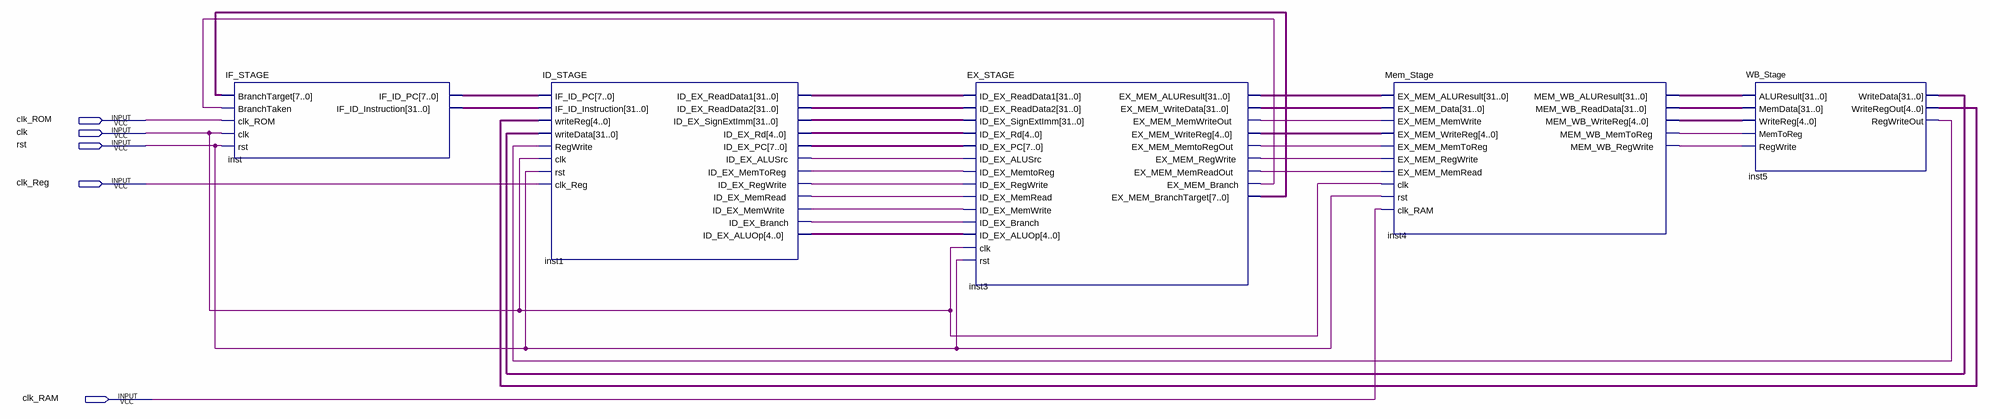
[diagram p0: schematic sheet]
// Quartus schematic ProcessadorPipeline.bdf as structural Verilog: 5 symbols, 5 pins
module ProcessadorPipeline (
  input  clk_ROM,
  input  clk,
  input  rst,
  input  clk_Reg,
  input  clk_RAM
);

  wire inst1_id_ex_alusrc, inst1_id_ex_branch, inst1_id_ex_memread, inst1_id_ex_memtoreg,
       inst1_id_ex_memwrite, inst1_id_ex_regwrite, inst3_ex_mem_branch, inst3_ex_mem_memreadout,
       inst3_ex_mem_memtoregout, inst3_ex_mem_memwriteout, inst3_ex_mem_regwrite, inst4_mem_wb_memtoreg,
       inst4_mem_wb_regwrite, inst5_regwriteout;
  wire [4:0] inst1_id_ex_aluop, inst1_id_ex_rd, inst3_ex_mem_writereg, inst4_mem_wb_writereg,
       inst5_writeregout;
  wire [7:0] inst1_id_ex_pc, inst3_ex_mem_branchtarget, inst_if_id_pc;
  wire [31:0] inst1_id_ex_readdata1, inst1_id_ex_readdata2, inst1_id_ex_signextimm, inst3_ex_mem_aluresult,
       inst3_ex_mem_writedata, inst4_mem_wb_aluresult, inst4_mem_wb_readdata, inst5_writedata,
       inst_if_id_instruction;

  IF_STAGE inst (
    .BranchTarget(inst3_ex_mem_branchtarget), .BranchTaken(inst3_ex_mem_branch), .clk_ROM(clk_ROM),
    .clk(clk), .rst(rst), .IF_ID_PC(inst_if_id_pc), .IF_ID_Instruction(inst_if_id_instruction));
  ID_STAGE inst1 (
    .IF_ID_PC(inst_if_id_pc), .IF_ID_Instruction(inst_if_id_instruction), .writeReg(inst5_writeregout),
    .writeData(inst5_writedata), .RegWrite(inst5_regwriteout), .clk(clk), .rst(rst), .clk_Reg(clk_Reg),
    .ID_EX_ReadData1(inst1_id_ex_readdata1), .ID_EX_ReadData2(inst1_id_ex_readdata2),
    .ID_EX_SignExtImm(inst1_id_ex_signextimm), .ID_EX_Rd(inst1_id_ex_rd), .ID_EX_PC(inst1_id_ex_pc),
    .ID_EX_ALUSrc(inst1_id_ex_alusrc), .ID_EX_MemToReg(inst1_id_ex_memtoreg),
    .ID_EX_RegWrite(inst1_id_ex_regwrite), .ID_EX_MemRead(inst1_id_ex_memread),
    .ID_EX_MemWrite(inst1_id_ex_memwrite), .ID_EX_Branch(inst1_id_ex_branch), .ID_EX_ALUOp(inst1_id_ex_aluop));
  EX_STAGE inst3 (
    .ID_EX_ReadData1(inst1_id_ex_readdata1), .ID_EX_ReadData2(inst1_id_ex_readdata2),
    .ID_EX_SignExtImm(inst1_id_ex_signextimm), .ID_EX_Rd(inst1_id_ex_rd), .ID_EX_PC(inst1_id_ex_pc),
    .ID_EX_ALUSrc(inst1_id_ex_alusrc), .ID_EX_MemtoReg(inst1_id_ex_memtoreg),
    .ID_EX_RegWrite(inst1_id_ex_regwrite), .ID_EX_MemRead(inst1_id_ex_memread),
    .ID_EX_MemWrite(inst1_id_ex_memwrite), .ID_EX_Branch(inst1_id_ex_branch),
    .ID_EX_ALUOp(inst1_id_ex_aluop), .clk(clk), .rst(rst), .EX_MEM_ALUResult(inst3_ex_mem_aluresult),
    .EX_MEM_WriteData(inst3_ex_mem_writedata), .EX_MEM_MemWriteOut(inst3_ex_mem_memwriteout),
    .EX_MEM_WriteReg(inst3_ex_mem_writereg), .EX_MEM_MemtoRegOut(inst3_ex_mem_memtoregout),
    .EX_MEM_RegWrite(inst3_ex_mem_regwrite), .EX_MEM_MemReadOut(inst3_ex_mem_memreadout),
    .EX_MEM_Branch(inst3_ex_mem_branch), .EX_MEM_BranchTarget(inst3_ex_mem_branchtarget));
  Mem_Stage inst4 (
    .EX_MEM_ALUResult(inst3_ex_mem_aluresult), .EX_MEM_Data(inst3_ex_mem_writedata),
    .EX_MEM_MemWrite(inst3_ex_mem_memwriteout), .EX_MEM_WriteReg(inst3_ex_mem_writereg),
    .EX_MEM_MemToReg(inst3_ex_mem_memtoregout), .EX_MEM_RegWrite(inst3_ex_mem_regwrite),
    .EX_MEM_MemRead(inst3_ex_mem_memreadout), .clk(clk), .rst(rst), .clk_RAM(clk_RAM),
    .MEM_WB_ALUResult(inst4_mem_wb_aluresult), .MEM_WB_ReadData(inst4_mem_wb_readdata),
    .MEM_WB_WriteReg(inst4_mem_wb_writereg), .MEM_WB_MemToReg(inst4_mem_wb_memtoreg),
    .MEM_WB_RegWrite(inst4_mem_wb_regwrite));
  WB_Stage inst5 (
    .ALUResult(inst4_mem_wb_aluresult), .MemData(inst4_mem_wb_readdata), .WriteReg(inst4_mem_wb_writereg),
    .MemToReg(inst4_mem_wb_memtoreg), .RegWrite(inst4_mem_wb_regwrite), .WriteData(inst5_writedata),
    .WriteRegOut(inst5_writeregout), .RegWriteOut(inst5_regwriteout));
endmodule
